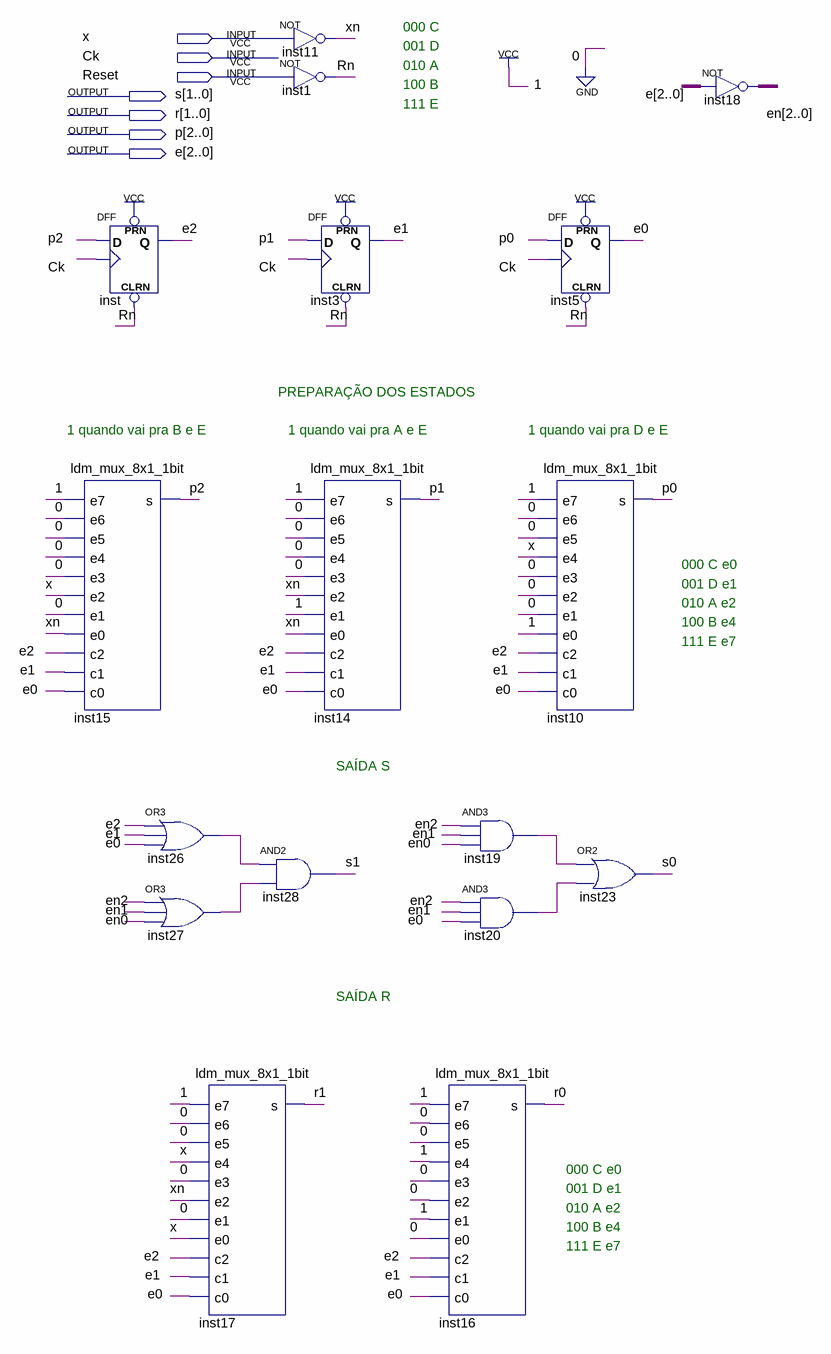
[diagram p0: schematic sheet]
// Quartus schematic ldm_fsm_tp8.bdf as structural Verilog: 17 symbols, 7 pins
module ldm_fsm_tp8 (
  input  x,
  input  Ck,
  input  Reset,
  output [1:0] s,
  output [1:0] r,
  output [2:0] p,
  output [2:0] e
);

  wire inst19_out, inst20_out, inst26_out, inst27_out, Rn, xn;
  wire [2:0] en;

  DFF inst (.CLRN(Rn), .CLK(Ck), .D(p[2]), .PRN(1'b1), .Q(e[2]));
  ldm_mux_8x1_1bit inst15 (
    .e7(1'b1), .e6(1'b0), .e5(1'b0), .e4(1'b0), .e3(1'b0), .e2(x), .e1(1'b0), .e0(xn), .c2(e[2]), .c1(e[1]),
    .c0(e[0]), .s(p[2]));
  or inst26 (inst26_out, e[2], e[1], e[0]);
  or inst27 (inst27_out, en[2], en[1], en[0]);
  ldm_mux_8x1_1bit inst17 (
    .e7(1'b1), .e6(1'b0), .e5(1'b0), .e4(x), .e3(1'b0), .e2(xn), .e1(1'b0), .e0(x), .c2(e[2]), .c1(e[1]),
    .c0(e[0]), .s(r[1]));
  and inst28 (s[1], inst26_out, inst27_out);
  not inst11 (xn, x);
  not inst1 (Rn, Reset);
  DFF inst3 (.CLRN(Rn), .CLK(Ck), .D(p[1]), .PRN(1'b1), .Q(e[1]));
  ldm_mux_8x1_1bit inst14 (
    .e7(1'b1), .e6(1'b0), .e5(1'b0), .e4(1'b0), .e3(1'b0), .e2(xn), .e1(1'b1), .e0(xn), .c2(e[2]), .c1(e[1]),
    .c0(e[0]), .s(p[1]));
  and inst19 (inst19_out, en[2], en[1], en[0]);
  and inst20 (inst20_out, en[2], en[1], e[0]);
  ldm_mux_8x1_1bit inst16 (
    .e7(1'b1), .e6(1'b0), .e5(1'b0), .e4(1'b1), .e3(1'b0), .e2(1'b0), .e1(1'b1), .e0(1'b0), .c2(e[2]),
    .c1(e[1]), .c0(e[0]), .s(r[0]));
  DFF inst5 (.CLRN(Rn), .CLK(Ck), .D(p[0]), .PRN(1'b1), .Q(e[0]));
  ldm_mux_8x1_1bit inst10 (
    .e7(1'b1), .e6(1'b0), .e5(1'b0), .e4(x), .e3(1'b0), .e2(1'b0), .e1(1'b0), .e0(1'b1), .c2(e[2]),
    .c1(e[1]), .c0(e[0]), .s(p[0]));
  or inst23 (s[0], inst19_out, inst20_out);
  assign en = ~e;  // NOT inst18, 3 bits wide

  // Notes on the sheet:
  //   000 C
  //   001 D
  //   010 A
  //   100 B
  //   111 E
  //   PREPARAÇÃO DOS ESTADOS
  //   1 quando vai pra B e E
  //   1 quando vai pra A e E
  //   1 quando vai pra D e E
  //   000 C e0
  //   001 D e1
  //   010 A e2
  //   100 B e4
  //   111 E e7
  //   SAÍDA S
  //   SAÍDA R
  //   000 C e0
  //   001 D e1
  //   010 A e2
  //   100 B e4
  //   111 E e7
endmodule
